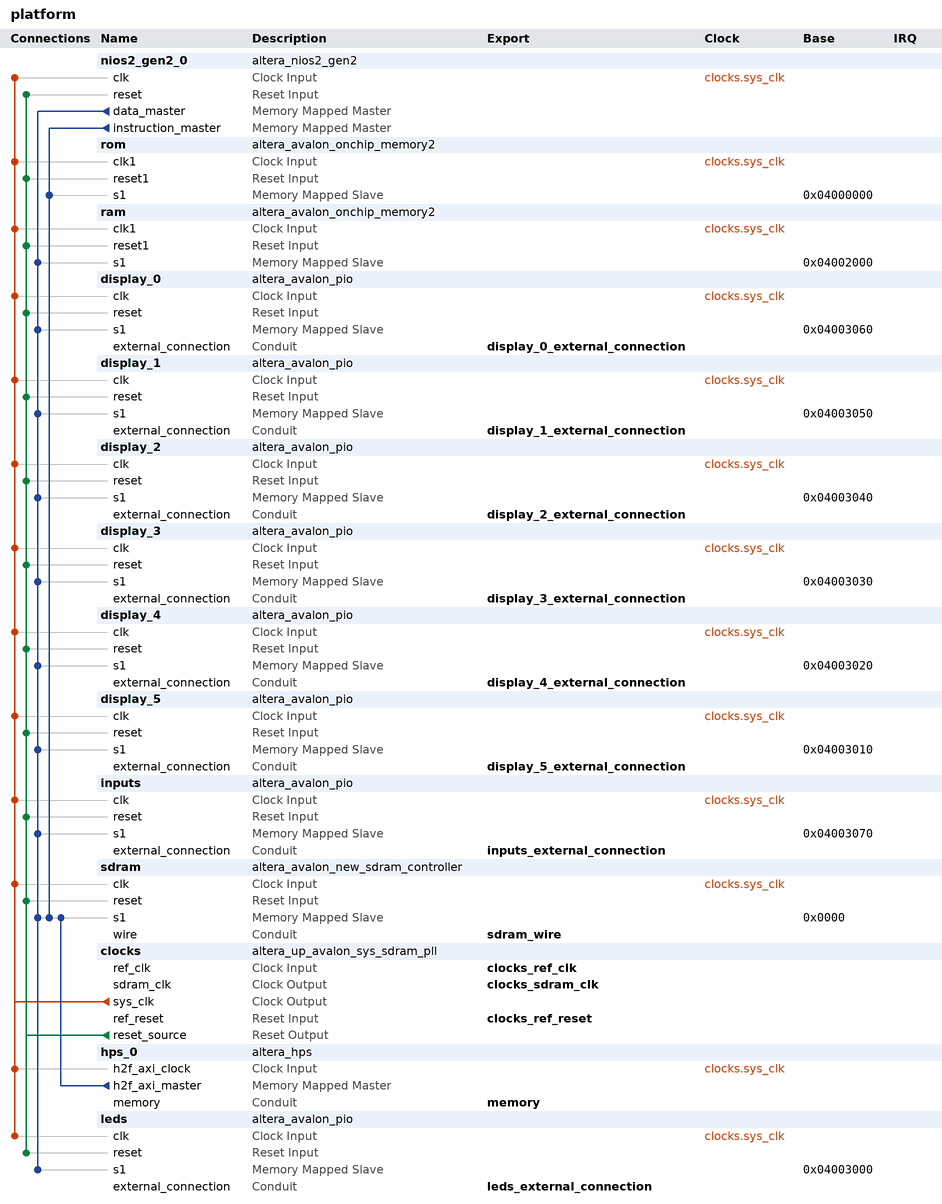
[diagram p0: system contents]
# Platform Designer (Qsys) system platform, Cyclone V 5CSEMA5F31C6
# Parameters at their usual value, and those the tool derives, are not listed.
package require -exact qsys 20.1
create_system platform
set_project_property DEVICE_FAMILY {Cyclone V}
set_project_property DEVICE 5CSEMA5F31C6

add_instance nios2_gen2_0 altera_nios2_gen2 20.1
set_instance_parameter_value nios2_gen2_0 dcache_size 2048
set_instance_parameter_value nios2_gen2_0 debug_enabled false
set_instance_parameter_value nios2_gen2_0 exceptionSlave rom.s1
set_instance_parameter_value nios2_gen2_0 icache_size 4096
set_instance_parameter_value nios2_gen2_0 impl Tiny
set_instance_parameter_value nios2_gen2_0 resetSlave rom.s1

add_instance rom altera_avalon_onchip_memory2 20.1
set_instance_parameter_value rom dataWidth 32
set_instance_parameter_value rom dualPort false
set_instance_parameter_value rom initMemContent true
set_instance_parameter_value rom initializationFileName onchip_mem.hex
set_instance_parameter_value rom memorySize 8192
set_instance_parameter_value rom writable false

add_instance ram altera_avalon_onchip_memory2 20.1
set_instance_parameter_value ram dataWidth 32
set_instance_parameter_value ram dualPort false
set_instance_parameter_value ram initMemContent true
set_instance_parameter_value ram initializationFileName onchip_mem.hex
set_instance_parameter_value ram memorySize 4096

add_instance display_0 altera_avalon_pio 20.1
set_instance_parameter_value display_0 direction Output
set_instance_parameter_value display_0 width 7

add_instance display_1 altera_avalon_pio 20.1
set_instance_parameter_value display_1 direction Output
set_instance_parameter_value display_1 width 7

add_instance display_2 altera_avalon_pio 20.1
set_instance_parameter_value display_2 direction Output
set_instance_parameter_value display_2 width 7

add_instance display_3 altera_avalon_pio 20.1
set_instance_parameter_value display_3 direction Output
set_instance_parameter_value display_3 width 7

add_instance display_4 altera_avalon_pio 20.1
set_instance_parameter_value display_4 direction Output
set_instance_parameter_value display_4 width 7

add_instance display_5 altera_avalon_pio 20.1
set_instance_parameter_value display_5 direction Output
set_instance_parameter_value display_5 width 7

add_instance inputs altera_avalon_pio 20.1
set_instance_parameter_value inputs direction Input
set_instance_parameter_value inputs width 5

add_instance sdram altera_avalon_new_sdram_controller 20.1
set_instance_parameter_value sdram TAC 5.4
set_instance_parameter_value sdram TRCD 15.0
set_instance_parameter_value sdram TRP 20.015
set_instance_parameter_value sdram casLatency 3
set_instance_parameter_value sdram columnWidth 10
set_instance_parameter_value sdram dataWidth 16
set_instance_parameter_value sdram generateSimulationModel false
set_instance_parameter_value sdram model single_Micron_MT48LC4M32B2_7_chip
set_instance_parameter_value sdram numberOfBanks 4
set_instance_parameter_value sdram numberOfChipSelects 1
set_instance_parameter_value sdram powerUpDelay 100.0
set_instance_parameter_value sdram refreshPeriod 7.8125
set_instance_parameter_value sdram rowWidth 13

add_instance clocks altera_up_avalon_sys_sdram_pll 18.0
set_instance_parameter_value clocks CV_boards DE1-SoC
set_instance_parameter_value clocks gui_outclk 50.0
set_instance_parameter_value clocks gui_refclk 50.0

add_instance hps_0 altera_hps 20.1
set_instance_parameter_value hps_0 EMAC1_Mode N/A
set_instance_parameter_value hps_0 EMAC1_PinMuxing Unused
set_instance_parameter_value hps_0 F2SCLK_COLDRST_Enable false
set_instance_parameter_value hps_0 F2SCLK_DBGRST_Enable false
set_instance_parameter_value hps_0 F2SCLK_WARMRST_Enable false
set_instance_parameter_value hps_0 F2SINTERRUPT_Enable false
set_instance_parameter_value hps_0 F2S_Width 0
set_instance_parameter_value hps_0 FPGA_PERIPHERAL_OUTPUT_CLOCK_FREQ_EMAC0_GTX_CLK 125
set_instance_parameter_value hps_0 FPGA_PERIPHERAL_OUTPUT_CLOCK_FREQ_EMAC0_MD_CLK 2.5
set_instance_parameter_value hps_0 FPGA_PERIPHERAL_OUTPUT_CLOCK_FREQ_EMAC1_GTX_CLK 125
set_instance_parameter_value hps_0 FPGA_PERIPHERAL_OUTPUT_CLOCK_FREQ_EMAC1_MD_CLK 2.5
set_instance_parameter_value hps_0 HPS_PROTOCOL DDR3
set_instance_parameter_value hps_0 I2C0_Mode N/A
set_instance_parameter_value hps_0 I2C0_PinMuxing Unused
set_instance_parameter_value hps_0 I2C1_Mode N/A
set_instance_parameter_value hps_0 I2C1_PinMuxing Unused
set_instance_parameter_value hps_0 LWH2F_Enable false
set_instance_parameter_value hps_0 MEM_BANKADDR_WIDTH 3
set_instance_parameter_value hps_0 MEM_CLK_FREQ 300.0
set_instance_parameter_value hps_0 MEM_CLK_FREQ_MAX 400.0
set_instance_parameter_value hps_0 MEM_COL_ADDR_WIDTH 8
set_instance_parameter_value hps_0 MEM_DQ_WIDTH 8
set_instance_parameter_value hps_0 MEM_DRV_STR RZQ/6
set_instance_parameter_value hps_0 MEM_ROW_ADDR_WIDTH 12
set_instance_parameter_value hps_0 MEM_RTT_NOM {ODT Disabled}
set_instance_parameter_value hps_0 MEM_RTT_WR {Dynamic ODT off}
set_instance_parameter_value hps_0 MEM_TCL 7
set_instance_parameter_value hps_0 MEM_TFAW_NS 37.5
set_instance_parameter_value hps_0 MEM_TINIT_US 499
set_instance_parameter_value hps_0 MEM_TMRD_CK 3
set_instance_parameter_value hps_0 MEM_TRAS_NS 40.0
set_instance_parameter_value hps_0 MEM_TRCD_NS 15.0
set_instance_parameter_value hps_0 MEM_TREFI_US 7.0
set_instance_parameter_value hps_0 MEM_TRFC_NS 75.0
set_instance_parameter_value hps_0 MEM_TRP_NS 15.0
set_instance_parameter_value hps_0 MEM_TWTR 2
set_instance_parameter_value hps_0 MEM_VENDOR JEDEC
set_instance_parameter_value hps_0 MEM_WTCL 6
set_instance_parameter_value hps_0 QSPI_Mode N/A
set_instance_parameter_value hps_0 QSPI_PinMuxing Unused
set_instance_parameter_value hps_0 REF_CLK_FREQ 125.0
set_instance_parameter_value hps_0 S2FCLK_USER2CLK 5
set_instance_parameter_value hps_0 S2F_Width 1
set_instance_parameter_value hps_0 SDIO_Mode N/A
set_instance_parameter_value hps_0 SDIO_PinMuxing Unused
set_instance_parameter_value hps_0 SPIM1_Mode N/A
set_instance_parameter_value hps_0 SPIM1_PinMuxing Unused
set_instance_parameter_value hps_0 STM_Enable false
set_instance_parameter_value hps_0 TIMING_BOARD_AC_SKEW 0.02
set_instance_parameter_value hps_0 TIMING_BOARD_AC_TO_CK_SKEW 0.0
set_instance_parameter_value hps_0 TIMING_BOARD_DQ_TO_DQS_SKEW 0.0
set_instance_parameter_value hps_0 TIMING_BOARD_MAX_CK_DELAY 0.6
set_instance_parameter_value hps_0 TIMING_BOARD_MAX_DQS_DELAY 0.6
set_instance_parameter_value hps_0 TIMING_BOARD_SKEW_BETWEEN_DQS 0.02
set_instance_parameter_value hps_0 TIMING_BOARD_SKEW_CKDQS_DIMM_MAX 0.01
set_instance_parameter_value hps_0 TIMING_BOARD_SKEW_CKDQS_DIMM_MIN -0.01
set_instance_parameter_value hps_0 TIMING_BOARD_SKEW_WITHIN_DQS 0.02
set_instance_parameter_value hps_0 TIMING_TDH 125
set_instance_parameter_value hps_0 TIMING_TDQSCK 400
set_instance_parameter_value hps_0 TIMING_TDQSQ 120
set_instance_parameter_value hps_0 TIMING_TDS 50
set_instance_parameter_value hps_0 TIMING_TIH 250
set_instance_parameter_value hps_0 TIMING_TIS 175
set_instance_parameter_value hps_0 TIMING_TQSH 0.38
set_instance_parameter_value hps_0 UART0_Mode N/A
set_instance_parameter_value hps_0 UART0_PinMuxing Unused
set_instance_parameter_value hps_0 USB1_Mode N/A
set_instance_parameter_value hps_0 USB1_PinMuxing Unused
set_instance_parameter_value hps_0 desired_cfg_clk_mhz 100.0
set_instance_parameter_value hps_0 desired_qspi_clk_mhz 400.0

add_instance leds altera_avalon_pio 20.1
set_instance_parameter_value leds direction Output
set_instance_parameter_value leds width 10

# connections
add_connection clocks.sys_clk display_0.clk clock
add_connection clocks.sys_clk display_1.clk clock
add_connection clocks.sys_clk display_2.clk clock
add_connection clocks.sys_clk display_3.clk clock
add_connection clocks.sys_clk display_4.clk clock
add_connection clocks.sys_clk display_5.clk clock
add_connection clocks.sys_clk hps_0.h2f_axi_clock clock
add_connection clocks.sys_clk inputs.clk clock
add_connection clocks.sys_clk leds.clk clock
add_connection clocks.sys_clk nios2_gen2_0.clk clock
add_connection clocks.sys_clk ram.clk1 clock
add_connection clocks.sys_clk rom.clk1 clock
add_connection clocks.sys_clk sdram.clk clock
add_connection clocks.reset_source display_0.reset reset
add_connection clocks.reset_source display_1.reset reset
add_connection clocks.reset_source display_2.reset reset
add_connection clocks.reset_source display_3.reset reset
add_connection clocks.reset_source display_4.reset reset
add_connection clocks.reset_source display_5.reset reset
add_connection clocks.reset_source inputs.reset reset
add_connection clocks.reset_source leds.reset reset
add_connection clocks.reset_source nios2_gen2_0.reset reset
add_connection clocks.reset_source ram.reset1 reset
add_connection clocks.reset_source rom.reset1 reset
add_connection clocks.reset_source sdram.reset reset
add_connection hps_0.h2f_axi_master sdram.s1 avalon
set_connection_parameter_value hps_0.h2f_axi_master/sdram.s1 baseAddress 0x0000
add_connection nios2_gen2_0.data_master display_0.s1 avalon
set_connection_parameter_value nios2_gen2_0.data_master/display_0.s1 baseAddress 0x04003060
add_connection nios2_gen2_0.data_master display_1.s1 avalon
set_connection_parameter_value nios2_gen2_0.data_master/display_1.s1 baseAddress 0x04003050
add_connection nios2_gen2_0.data_master display_2.s1 avalon
set_connection_parameter_value nios2_gen2_0.data_master/display_2.s1 baseAddress 0x04003040
add_connection nios2_gen2_0.data_master display_3.s1 avalon
set_connection_parameter_value nios2_gen2_0.data_master/display_3.s1 baseAddress 0x04003030
add_connection nios2_gen2_0.data_master display_4.s1 avalon
set_connection_parameter_value nios2_gen2_0.data_master/display_4.s1 baseAddress 0x04003020
add_connection nios2_gen2_0.data_master display_5.s1 avalon
set_connection_parameter_value nios2_gen2_0.data_master/display_5.s1 baseAddress 0x04003010
add_connection nios2_gen2_0.data_master inputs.s1 avalon
set_connection_parameter_value nios2_gen2_0.data_master/inputs.s1 baseAddress 0x04003070
add_connection nios2_gen2_0.data_master leds.s1 avalon
set_connection_parameter_value nios2_gen2_0.data_master/leds.s1 baseAddress 0x04003000
add_connection nios2_gen2_0.data_master ram.s1 avalon
set_connection_parameter_value nios2_gen2_0.data_master/ram.s1 baseAddress 0x04002000
add_connection nios2_gen2_0.data_master sdram.s1 avalon
set_connection_parameter_value nios2_gen2_0.data_master/sdram.s1 baseAddress 0x0000
add_connection nios2_gen2_0.instruction_master rom.s1 avalon
set_connection_parameter_value nios2_gen2_0.instruction_master/rom.s1 baseAddress 0x04000000
add_connection nios2_gen2_0.instruction_master sdram.s1 avalon
set_connection_parameter_value nios2_gen2_0.instruction_master/sdram.s1 baseAddress 0x0000

# exported interfaces
add_interface clocks_ref_clk clock sink
set_interface_property clocks_ref_clk EXPORT_OF clocks.ref_clk
add_interface clocks_ref_reset reset sink
set_interface_property clocks_ref_reset EXPORT_OF clocks.ref_reset
add_interface clocks_sdram_clk clock source
set_interface_property clocks_sdram_clk EXPORT_OF clocks.sdram_clk
add_interface display_0_external_connection conduit end
set_interface_property display_0_external_connection EXPORT_OF display_0.external_connection
add_interface display_1_external_connection conduit end
set_interface_property display_1_external_connection EXPORT_OF display_1.external_connection
add_interface display_2_external_connection conduit end
set_interface_property display_2_external_connection EXPORT_OF display_2.external_connection
add_interface display_3_external_connection conduit end
set_interface_property display_3_external_connection EXPORT_OF display_3.external_connection
add_interface display_4_external_connection conduit end
set_interface_property display_4_external_connection EXPORT_OF display_4.external_connection
add_interface display_5_external_connection conduit end
set_interface_property display_5_external_connection EXPORT_OF display_5.external_connection
add_interface inputs_external_connection conduit end
set_interface_property inputs_external_connection EXPORT_OF inputs.external_connection
add_interface leds_external_connection conduit end
set_interface_property leds_external_connection EXPORT_OF leds.external_connection
add_interface memory conduit end
set_interface_property memory EXPORT_OF hps_0.memory
add_interface sdram_wire conduit end
set_interface_property sdram_wire EXPORT_OF sdram.wire

set_interconnect_requirement {$system} qsys_mm.clockCrossingAdapter HANDSHAKE
set_interconnect_requirement {$system} qsys_mm.enableEccProtection FALSE
set_interconnect_requirement {$system} qsys_mm.insertDefaultSlave FALSE
set_interconnect_requirement {$system} qsys_mm.maxAdditionalLatency 1

save_system platform.qsys
